# EAGLE design wing-spiadc (EAGLE 5.06)
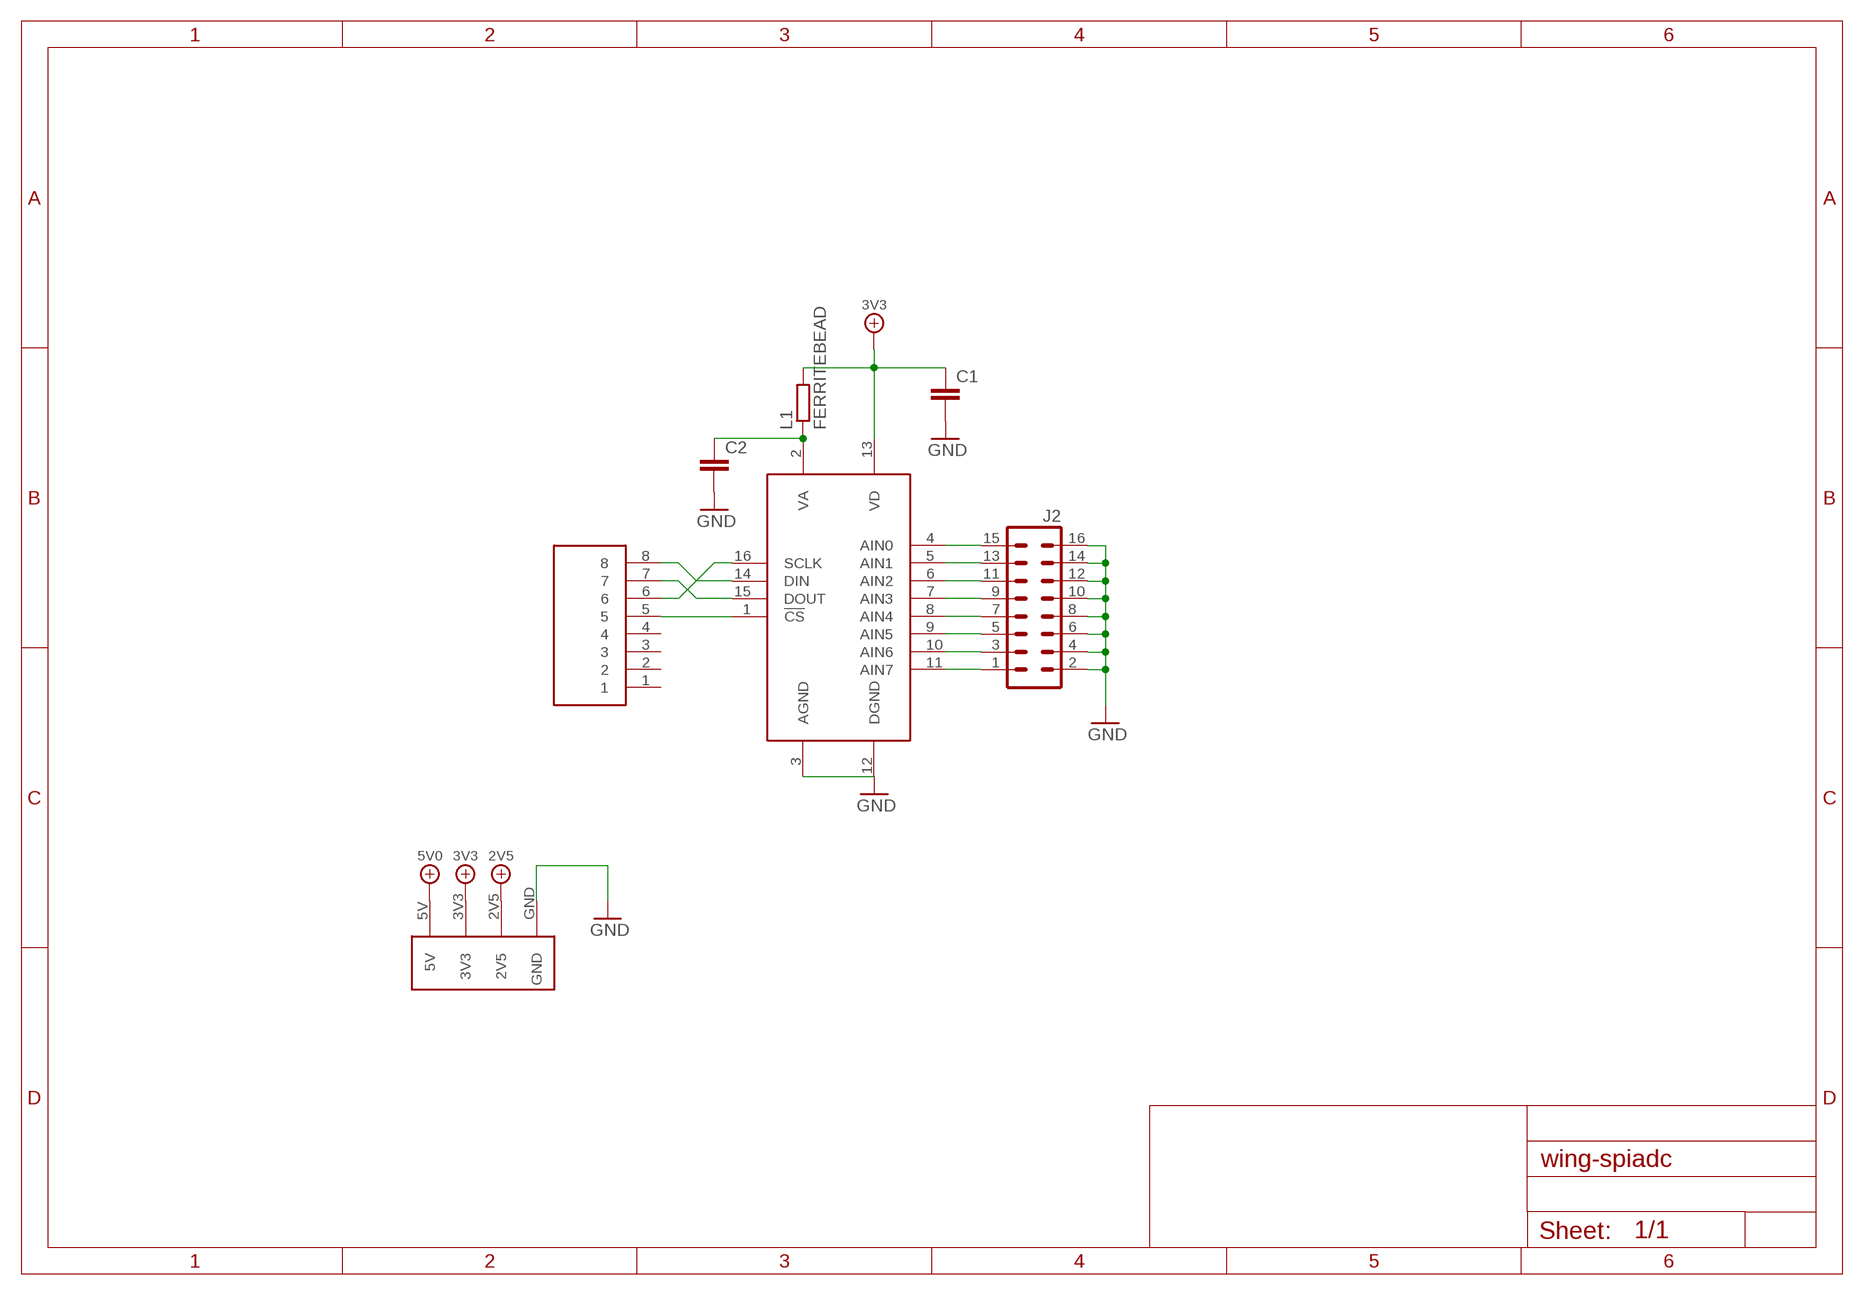
[diagram p0: schematic, sheet 1]

## Parts
C1  C-EUC0603  [C0603]
C2  C-EUC0603  [C0603]
J1  COCOON_8BIT_SEGMENT  [COCOON_8BIT_SEGMENT]
J2  MA08-2  [MA08-2]
L1  FERRITEBEAD  R-EU_R0603  [R0603]
U1  ADC088S102CIMT  [TSSOP16]

## Nets
2V5: J1.2V5
3V3: C1.1 J1.3V3 L1.2 U1.13(VD)
5V0: J1.5V
GND: C1.2 C2.2 J1.GND J2.2 J2.4 J2.6 J2.8 J2.10 J2.12 J2.14 J2.16 U1.3(AGND) U1.12(DGND)
N$1: J2.1 U1.11(AIN7)
N$2: J2.3 U1.10(AIN6)
N$3: J2.5 U1.9(AIN5)
N$4: J2.7 U1.8(AIN4)
N$5: J2.9 U1.7(AIN3)
N$6: J2.11 U1.6(AIN2)
N$7: J2.13 U1.5(AIN1)
N$8: J2.15 U1.4(AIN0)
N$9: C2.1 L1.1 U1.2(VA)
N$10: J1.5 U1.1(!CS)
N$11: J1.6 U1.16(SCLK)
N$12: J1.7 U1.15(DOUT)
N$13: J1.8 U1.14(DIN)
Unconnected: J1.1 J1.2 J1.3 J1.4

## Library data of the parts
C1 C2 = rcl:C-EU: CAPACITOR, European symbol
J1 = GadgetFactory_Pub:COCOON_8BIT_SEGMENT
J2 = con-lstb:MA08-2: PIN HEADER
L1 = rcl:R-EU_: RESISTOR, European symbol
U1 = spiadc:ADC088S102

## Board
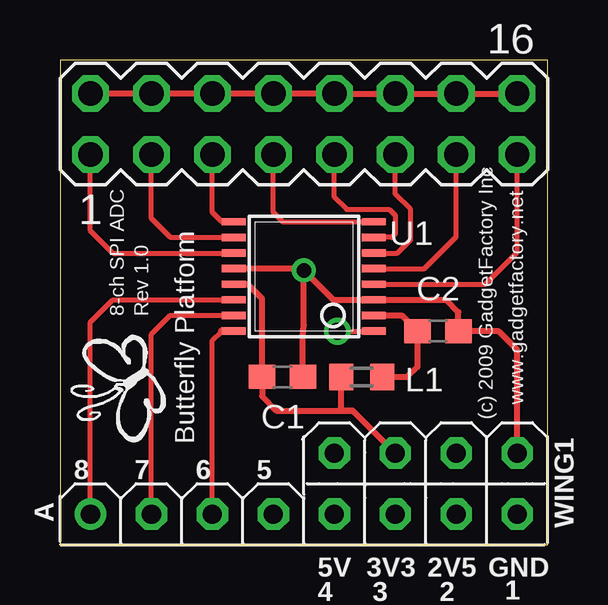
[diagram p1: board, top side]
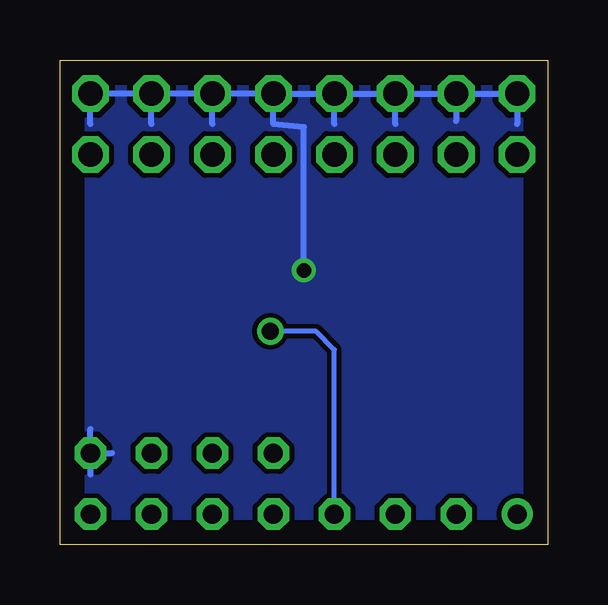
[diagram p2: board, bottom side, seen from below]

Size 20.32 x 20.19 mm. Coordinates in mm from the lower left corner, seen from the top.
Outline: 0,0 20.32,0 20.32,20.19 0,20.19 0,0
Copper layers (1*16): Top 0.035mm / dielectric 1.5mm / Bottom 0.035mm
Design rules "default": minimum track width 10mil, minimum drill 24mil, track to track 8mil, track to pad 8mil, pad to pad 8mil, via to via 8mil, smd to smd 8mil, copper to edge 40mil, drill to drill 8mil, minimum pad ring 10mil, minimum via ring 8mil, stop-mask expansion 4mil, vias tented up to drill 0mil, thermal gap 10mil

### Footprints (pad centres in the part's own frame; a part is rotated, then mirrored left to right if it is on the bottom)
C0603 = smd 1.1 x 1: 1 -0.85,0; 2 0.85,0
COCOON_8BIT_SEGMENT = drill 0.8 octagon: 1 -1.27,-8.89; 2 -1.27,-6.35; 2V5 1.27,-6.35; 3 -1.27,-3.81; 3V3 1.27,-3.81; 4 -1.27,-1.27; 5 -1.27,1.27; 5V 1.27,-1.27; 6 -1.27,3.81; 7 -1.27,6.35; GND 1.27,-8.89 | drill 0.8 round: 8 -1.27,8.89
MA08-2 = drill 1.016 octagon: 1 -8.89,-1.27; 2 -8.89,1.27; 3 -6.35,-1.27; 4 -6.35,1.27; 5 -3.81,-1.27; 6 -3.81,1.27; 7 -1.27,-1.27; 8 -1.27,1.27; 9 1.27,-1.27; 10 1.27,1.27; 11 3.81,-1.27; 12 3.81,1.27; 13 6.35,-1.27; 14 6.35,1.27; 15 8.89,-1.27; 16 8.89,1.27
R0603 = smd 1 x 1.1: 1 -0.85,0; 2 0.85,0
TSSOP16 = smd 0.305 x 0.991: 1 -2.275,-2.918; 2 -1.625,-2.918; 3 -0.975,-2.918; 4 -0.325,-2.918; 5 0.325,-2.918; 6 0.975,-2.918; 7 1.625,-2.918; 8 2.275,-2.918; 9 2.275,2.918; 10 1.625,2.918; 11 0.975,2.918; 12 0.325,2.918; 13 -0.325,2.918; 14 -0.975,2.918; 15 -1.625,2.918; 16 -2.275,2.918

### Placement (x,y rotation side)
C1  9.27,6.99 0 top
C2  15.75,8.89 0 top
J1  10.16,2.54 90 top
J2  10.16,17.53 0 top
L1  12.57,6.99 180 top
U1  10.16,11.18 90 top

### Tracks (layer width: path | path; a pad name or v marks a point on that pad's centre or on a via)
3V3
  Top 0.254: U1.13 7.82,10.85 8.42,10.25 C1.1 8.42,6.18 9.02,5.59 12.19,5.59 | 12.19,5.59 J1.3V3 | 12.19,5.59 11.72,5.59 L1.2
GND  (via drill 0.6)
  Top 0.254: C1.2 10.12,8.68 10.16,9.14 v10.16,11.43 | J2.2 J2.4 J2.6 J2.8 J2.10 J2.12 J2.14 J2.16 | J1.GND 19.05,8.13 18.29,8.89 C2.2 16.6,9.69 16.09,10.2 U1.3 11.39,10.2 v10.16,11.43 | U1.12 10.09,11.5 v10.16,11.43
  Bottom 0.254: J2.10 11.43,17.53 10.16,17.4 v10.16,11.43 10.16,11.3 | J2.10 J2.12 J2.14 J2.16 | J2.4 J2.2 1.27,17.53 | J2.4 J2.6 J2.8 J2.10 | J1.GND 19.05,2.92 | J1.GND 19.05,4.83 | J1.GND 18.16,3.81 | 13.97,17.53 13.97,18.54 | 8.89,17.53 8.89,18.67 | 6.35,17.53 6.35,18.67 | 16.51,17.53 16.51,18.67 | 19.05,17.53 19.05,18.54 | J2.4 3.81,17.65
  pour Bottom: 0,0 0,20.19 20.32,20.19 20.32,0
N$1
  Top 0.203: J2.1 1.27,13.08 2.2,12.15 U1.11
N$2
  Top 0.203: J2.3 3.81,13.59 4.6,12.8 U1.10
N$3
  Top 0.203: J2.5 6.35,13.84 6.73,13.46 7.23,13.46 U1.9
N$4
  Top 0.203: U1.8 9.28,13.45 8.89,13.84 J2.7
N$5
  Top 0.203: J2.9 11.43,14.48 11.94,13.97 13.72,13.97 13.97,13.72 13.97,12.95 13.82,12.8 U1.7
N$6
  Top 0.203: U1.6 14.06,12.15 14.61,12.7 14.61,13.97 13.97,14.61 J2.11
N$7
  Top 0.203: U1.5 15.18,11.5 16.51,12.83 J2.13
N$8
  Top 0.203: U1.4 17.71,10.85 19.05,12.19 J2.15
N$9
  Top 0.254: L1.1 14.48,6.99 14.9,7.41 C2.1 14.24,9.55 U1.2
N$10  (via drill 0.7)
  Top 0.203: U1.1 v11.57,8.9 v11.56,8.89
  Bottom 0.203: v11.56,8.89 9.65,8.89 8.89,8.13 J1.5
N$11
  Top 0.203: J1.6 6.35,8.51 6.73,8.89
  Top 0.305: 6.73,8.89 U1.16
N$12
  Top 0.203: J1.7 3.81,8.76 4.6,9.55 U1.15
N$13
  Top 0.203: J1.8 1.27,9.27 2.2,10.2 U1.14

### Text on the board
tPlace: 8-ch SPI ADC | Rev 1.0 | www.gadgetfactory.net | (c) 2009 GadgetFactory Inc | Butterfly Platform